# Altium schematic sheet LDO.SchDoc
size A4; SheetNumber: 5; SheetTotal: 13
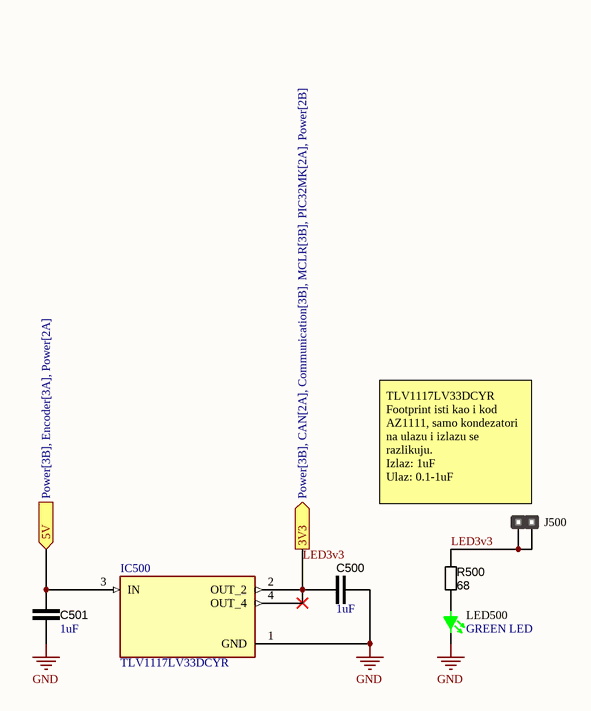
[diagram p0: LDO.SchDoc]

## Parts
C500  1uF  [CAP_1206]
C501  1uF  [CAP_1206]
IC500  TLV1117LV33DCYR  [VREG_TLV1117LV33DCYR]
J500  *  [HM1x2]  (value not drawn)
LED500  GREEN LED  [DIOC1608X04N]
R500  68  [RES_0603]

## Ports
3V3 (out, see Power[3B], CAN[2A], Communication[3B], MCLR[3B], PIC32MK[2A], Power[2B]), 5V (in, see Power[3B], Encoder[3A], Power[2A])

## Nets
GND: C500.1 C501.2 IC500.1(GND) LED500.2
5V: C501.1 IC500.3(IN) ; port 5V
LED3v3: C500.2 IC500.2(OUT_2) IC500.4(OUT_4) J500.1 J500.2 R500.2 ; port 3V3
NetLED500_1: LED500.1 R500.1

## Notes on the sheet
- (near J500) TLV1117LV33DCYR
  Footprint isti kao i kod AZ1111, samo kondezatori na ulazu i izlazu se razlikuju.
  Izlaz: 1uF
  Ulaz: 0.1-1uF

## Library data of the parts
C500 C501 = C000020: 1 µF ±10% 25V Ceramic Capacitor X5R 1206 (3216 Metric); capacitance: 22uF; ComponentLink1Description: DigiKey; ComponentLink1URL: https://www.digikey.com/en/products/detail/samsung-electro-mechanics/CL31A226KAHNNNE/3888705; DigiKey Part Number: 1276-3047-1-ND
IC500 = TLV1117LV33DCYR: 1-A, low-dropout voltage regulator 4-SOT-223 -40 to 125; MF: {'manufacturer': u'Texas Instruments'}; Package: None; Price: None; Value: *; MP: TLV1117LV33DCYR; Availability: Unavailable
J500 = HEADER_1x2: Manufacturer Part Number: *
LED500 = 00000001: LED GREEN DIFFUSED 0603 SMD; Supplier 1: Avnet; Supplier Part Number 1: Q65111A3964; ComponentLink1Description: Digikey; ComponentLink1URL: https://www.digikey.com/en/products/detail/ams-osram-usa-inc/LG-Q396-PS-35/5249855
R500 = R000004: RES 68 OHM 1% 1/10W 0603; resistance: 1Kohm; ComponentLink1Description: digikey; ComponentLink1URL: https://www.digikey.com/en/products/detail/vishay-beyschlag-draloric-bc-components/MCT06030C1001FP500/2607821